# EAGLE design BLE_Node (EAGLE 6.5.0)
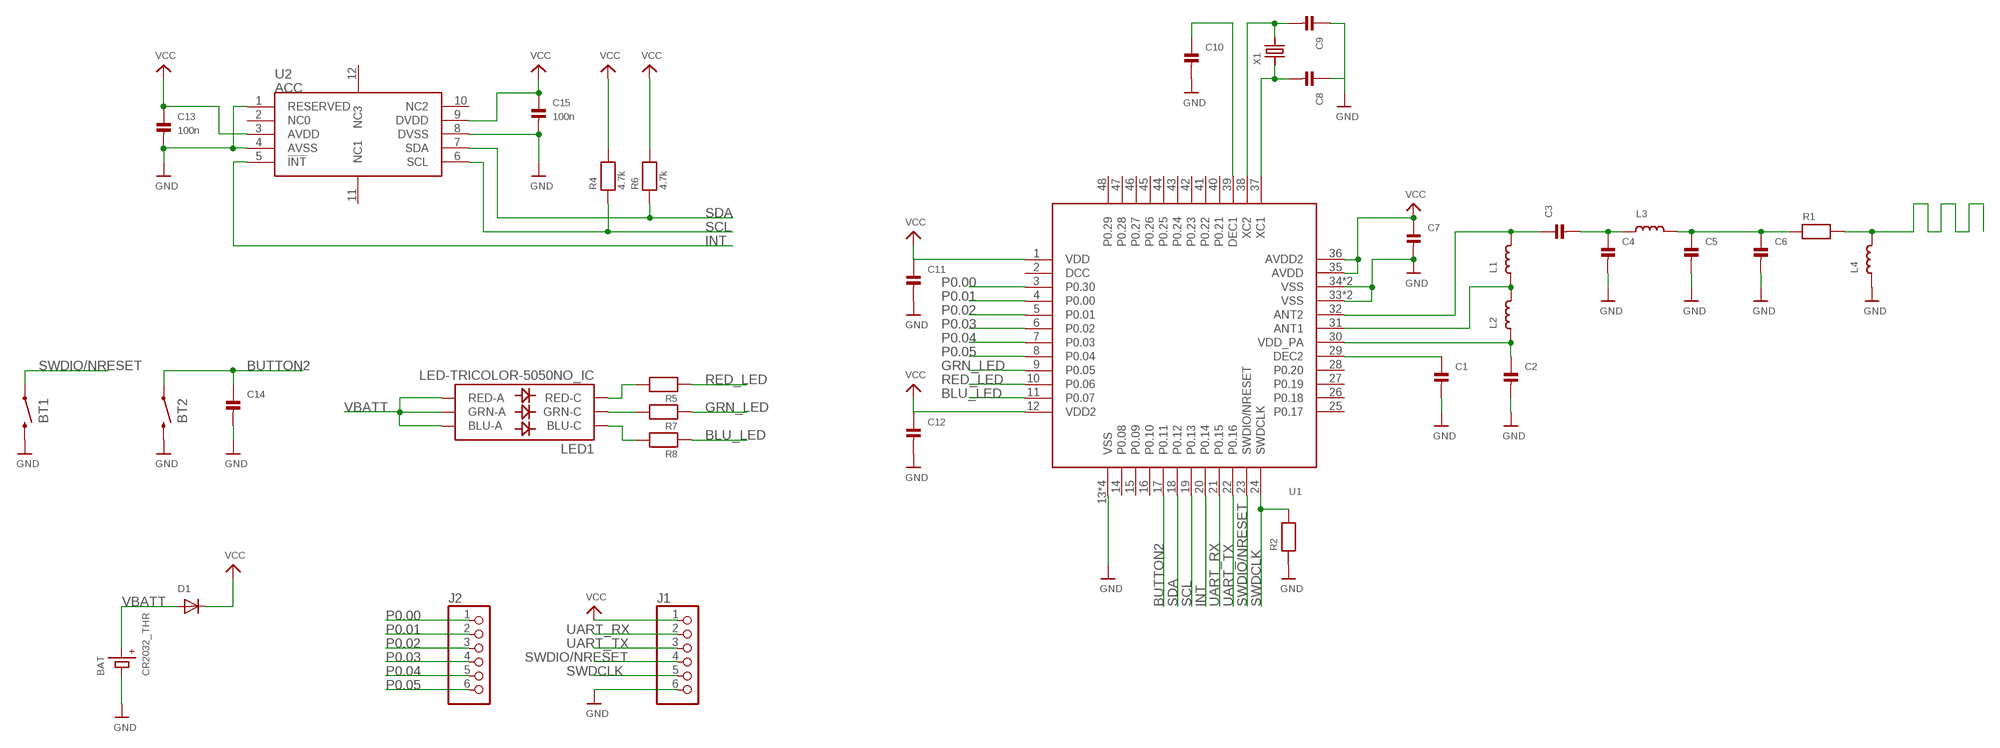
[diagram p0: schematic, sheet 1]

## Parts
BAT  CR2032_THR  [CR2032_THR]
BT1  TACT_SWITCH_3.5MM_6MM  [TACT_SW_3.5MM_6MM]
BT2  TACT_SWITCH_3.5MM_6MM  [TACT_SW_3.5MM_6MM]
C1  NRF51_CAP_0402  [NRF51_CAP_0402]
C2  NRF51_CAP_0402  [NRF51_CAP_0402]
C3  NRF51_CAP_0402  [NRF51_CAP_0402]
C4  NRF51_CAP_0402  [NRF51_CAP_0402]
C5  NRF51_CAP_0402  [NRF51_CAP_0402]
C6  NRF51_CAP_0402  [NRF51_CAP_0402]
C7  NRF51_CAP_0402  [NRF51_CAP_0402]
C8  NRF51_CAP_0402  [NRF51_CAP_0402]
C9  NRF51_CAP_0402  [NRF51_CAP_0402]
C10  NRF51_CAP_0402  [NRF51_CAP_0402]
C11  NRF51_CAP_0402  [NRF51_CAP_0402]
C12  NRF51_CAP_0402  [NRF51_CAP_0402]
C13  100n  NRF51_CAP_0402  [NRF51_CAP_0402]
C14  NRF51_CAP_0402  [NRF51_CAP_0402]
C15  100n  NRF51_CAP_0402  [NRF51_CAP_0402]
D1  DIODESOT23_REFLOW  [SOT23-R]
J1  HEADER-1X6ROUND  [1X06_ROUND]
J2  HEADER-1X6ROUND  [1X06_ROUND]
L1  NRF51_IND_0402  [NRF51_IND_0402]
L2  NRF51_IND_0402  [NRF51_IND_0402]
L3  NRF51_IND_0402  [NRF51_IND_0402]
L4  NRF51_IND_0402  [NRF51_IND_0402]
LED1  LED-TRICOLOR-5050NO_IC  [LED-TRICOLOR-5050]
R1  NRF51_RES_0402  [NRF51_RES_0402]
R2  NRF51_RES_0402  [NRF51_RES_0402]
R4  4.7k  NRF51_RES_0402  [NRF51_RES_0402]
R5  NRF51_RES_0402  [NRF51_RES_0402]
R6  4.7k  NRF51_RES_0402  [NRF51_RES_0402]
R7  NRF51_RES_0402  [NRF51_RES_0402]
R8  NRF51_RES_0402  [NRF51_RES_0402]
U1  NRF51822_QFN48  [NORDIC_QFN48]
U2  ACC  MMA7660FC_DFN10  [DFN10]
X1  TSX-3225_16MHZ  [XTAL_3.2X2.5]

## Nets
BLU_LED: R8.1 U1.11(P0.07)
BUTTON2: BT2.1 C14.1 U1.17(P0.11)
GND: BAT.5(-) BT1.2 BT2.2 C1.2 C2.2 C4.2 C5.2 C6.2 C7.2 C8.1 C9.1 C10.2 C11.2 C12.2 C13.2 C14.2 C15.2 J1.6 L4.1 R2.1 U1.13(VSS) U1.33(VSS) U1.34(VSS) U1.49(VSS) U1.50(VSS) U1.51(VSS) U1.52(VSS) U1.53(VSS) U2.1(RESERVED) U2.4(AVSS) U2.8(DVSS)
GRN_LED: R7.1 U1.9(P0.05)
INT: U1.20(P0.14) U2.5(!INT)
N$1: L1.1 L2.2 U1.31(ANT1)
N$2: C1.1 U1.29(DEC2)
N$3: C2.1 L2.1 U1.30(VDD_PA)
N$4: C3.1 L1.2 U1.32(ANT2)
N$5: C3.2 C4.1 L3.1
N$6: C5.1 C6.1 L3.2 R1.1
N$7: L4.2 R1.2
N$9: C8.2 U1.37(XC1) X1.1
N$10: C9.2 U1.38(XC2) X1.3
N$11: C10.1 U1.39(DEC1)
N$12: LED1.5(RED-C) R5.2
N$13: LED1.6(GRN-C) R7.2
N$14: LED1.4(BLU-C) R8.2
P0.00: J2.1 U1.3(P0.30)
P0.01: J2.2 U1.4(P0.00)
P0.02: J2.3 U1.5(P0.01)
P0.03: J2.4 U1.6(P0.02)
P0.04: J2.5 U1.7(P0.03)
P0.05: J2.6 U1.8(P0.04)
RED_LED: R5.1 U1.10(P0.06)
SCL: R4.1 U1.19(P0.13) U2.6(SCL)
SDA: R6.1 U1.18(P0.12) U2.7(SDA)
SWDCLK: J1.5 R2.2 U1.24(SWDCLK)
SWDIO/NRESET: BT1.1 J1.4 U1.23(SWDIO/NRESET)
UART_RX: J1.2 U1.21(P0.15)
UART_TX: J1.3 U1.22(P0.16)
VBATT: BAT.1(+) BAT.2(+) BAT.3(+) BAT.4(+) D1.1(A) LED1.1(GRN-A) LED1.2(RED-A) LED1.3(BLU-A)
VCC: C7.1 C11.1 C12.1 C13.1 C15.1 D1.3(C) J1.1 R4.2 R6.2 U1.1(VDD) U1.12(VDD2) U1.35(AVDD) U1.36(AVDD2) U2.3(AVDD) U2.9(DVDD)
Unconnected: U1.2(DCC) U1.14(P0.08) U1.15(P0.09) U1.16(P0.10) U1.25(P0.17) U1.26(P0.18) U1.27(P0.19) U1.28(P0.20) U1.40(P0.21) U1.41(P0.22) U1.42(P0.23) U1.43(P0.24) U1.44(P0.25) U1.45(P0.26) U1.46(P0.27) U1.47(P0.28) U1.48(P0.29) U2.2(NC0) U2.10(NC2) U2.11(NC1) U2.12(NC3)

## Library data of the parts
BAT = wavelette:CR2032_THR
BT1 BT2 = wavelette:TACT_SWITCH_3.5MM_6MM
C1-C15 = microbuilder:NRF51_CAP_0402
D1 = microbuilder:DIODE: Diode SMA Model Volts Amps Type Vf Vr Digikey # Notes SSA34-E3 40V 3A Schottky 480mV @ 3A 200uA @ 40V SSA34-E3/61TGITR-ND CDBA120-G 20V 1A Schottky 500mV @ 1A 500uA @ 20V 641-1014-6-ND REEL MBRA210 10V 2A Schottky 350mV @ 2A 700uA @ 10V MBRA210LT3 SOD-123 Model Volts Amps Type Vf Vr Order # Notes BAT54T1G 30V 200mA Schottky 800mV @ 200mA 2uA @ 25V BAT54T1GOSTR-ND B0530W 30V 500mA Schottky 430mV @ 500mA 130uA @ 30V B0530W-FDICT-ND REEL MBR120 1A 20V Schottky 340mV @ 1A MBR120VLSFT1GOSCT-ND SOD-323 Model Volts Amps Type Vf Vr Order # Notes PMEG2005EJ 20V 500mA Schottky 355mV @ 500mA 568-4110-1-ND ZLLS410 10V 570mA Schottky 380mV @ 570mA ZLLS410CT-ND 1N4148WS 75V 150mA Silicon/Simple 1V 1N4148WSFSCT-ND REEL SOD-523 Model Volts Amps Type Vf Vr Order # Notes BAT54XV2 30V 200mA Schottky 0.8V @ 100mA BAT54XV2CT-ND TB751S 30V 30mA Schottky RB751S-40TE61CT-ND SOT23-R/W (R = Solder Paste/Reflow Ovens, W = Hand-Soldering) Model Volts Amps Type Vf Vr Order # Notes BAT54FILM 40V 300mA Schottky 497-7162-1-ND
J1 J2 = microbuilder:HEADER-1X6: PIN HEADER
L1-L4 = microbuilder:NRF51_IND_0402
LED1 = SparkFun-LED:LED-TRICOLOR-5050
R1 R2 R4-R8 = microbuilder:NRF51_RES_0402
U1 = wavelette:NRF51822_QFN48
U2 = ICs_v54:MMA7660FC
X1 = wavelette:TSX-3225_16MHZ

## Board
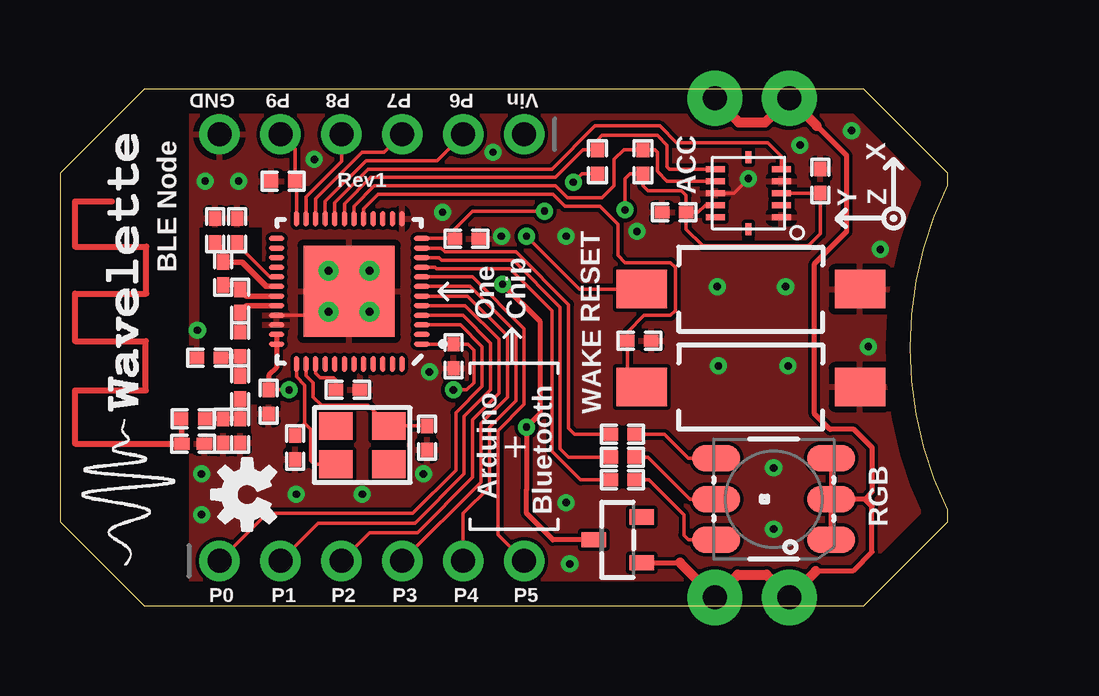
[diagram p1: board, top side]
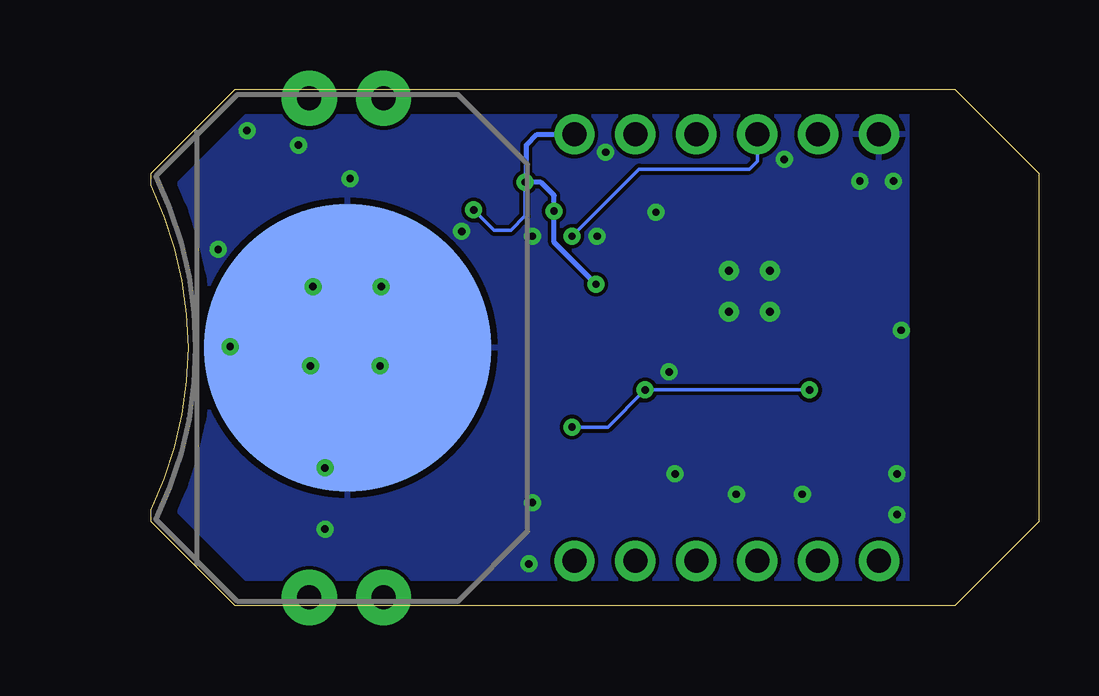
[diagram p2: board, bottom side, seen from below]

Size 37 x 21.52 mm. Coordinates in mm from the lower left corner, seen from the top.
Outline: 3.5,0 33.5,0 37,3.5 37,4 arc-52 37,17.52 37,18.02 33.5,21.52 3.5,21.52 0,18.02 0,3.5 3.5,0
Copper layers (1*16): Top 0.035mm / dielectric 1.5mm / Bottom 0.035mm
Design rules "default *": minimum track width 6mil, minimum drill 12mil, track to track 6mil, track to pad 6mil, pad to pad 6mil, via to via 6mil, smd to smd 0mil, copper to edge 40mil, drill to drill 8mil, minimum pad ring 10mil, minimum via ring 8mil, stop-mask expansion 4mil, vias tented up to drill 14mil, thermal gap 10mil
tRestrict: area 5.8,9.2 to 8.4,15.8; area 5.2,8.4 to 8.8,10; area 5.1,7.2 to 7.9,8.8; area 0,0 to 5.4,21.5
bRestrict: area 0,0 to 5.4,21.5

### Footprints (pad centres in the part's own frame; a part is rotated, then mirrored left to right if it is on the bottom)
CR2032_THR = drill 1 pad 2.3: 1 -10.4,1.5; 2 -10.4,-1.6; 3 10.4,1.5; 4 10.4,-1.6 | smd 12 x 12: 5 0,0
TACT_SW_3.5MM_6MM = smd 2.1 x 1.6: 1 -4.55,0; 2 4.55,0
NRF51_CAP_0402 = smd 0.6 x 0.5: 1 -0.5,0; 2 0.5,0
SOT23-R = smd 0.635 x 1.016: 1 -0.95,-1; 2 0.95,-1; 3 0,1
1X06_ROUND = drill 1 pad 1.676: 1 -6.35,0; 2 -3.81,0; 3 -1.27,0; 4 1.27,0; 5 3.81,0; 6 6.35,0
NRF51_IND_0402 = smd 0.65 x 0.5: 1 -0.475,0; 2 0.475,0
LED-TRICOLOR-5050 = smd 2 x 1.1: 1 -2.4,1.7; 2 -2.4,0; 3 -2.4,-1.7; 4 2.4,-1.7; 5 2.4,0; 6 2.4,1.7
NRF51_RES_0402 = smd 0.6 x 0.55: 1 -0.5,0; 2 0.5,0
NORDIC_QFN48 = smd 0.65 x 0.2: 1 -3.025,2.2; 2 -3.025,1.8; 3 -3.025,1.4; 4 -3.025,1; 5 -3.025,0.6; 6 -3.025,0.2; 7 -3.025,-0.2; 8 -3.025,-0.6; 9 -3.025,-1; 10 -3.025,-1.4; 11 -3.025,-1.8; 12 -3.025,-2.2; 25 3.025,-2.2; 26 3.025,-1.8; 27 3.025,-1.4; 28 3.025,-1; 29 3.025,-0.6; 30 3.025,-0.2; 31 3.025,0.2; 32 3.025,0.6; 33 3.025,1; 34 3.025,1.4; 35 3.025,1.8; 36 3.025,2.2 | smd 0.2 x 0.65: 13 -2.2,-3.025; 14 -1.8,-3.025; 15 -1.4,-3.025; 16 -1,-3.025; 17 -0.6,-3.025; 18 -0.2,-3.025; 19 0.2,-3.025; 20 0.6,-3.025; 21 1,-3.025; 22 1.4,-3.025; 23 1.8,-3.025; 24 2.2,-3.025; 37 2.2,3.025; 38 1.8,3.025; 39 1.4,3.025; 40 1,3.025; 41 0.6,3.025; 42 0.2,3.025; 43 -0.2,3.025; 44 -0.6,3.025; 45 -1,3.025; 46 -1.4,3.025; 47 -1.8,3.025; 48 -2.2,3.025 | smd 3.8 x 3.8: 49 0,0 | drill 0.33 pad 0.66: 50 -0.85,0.85; 51 0.85,0.85; 52 -0.85,-0.85; 53 0.85,-0.85
DFN10 = smd 0.8 x 0.25: 1 -1.375,1; 2 -1.375,0.5; 3 -1.375,0; 4 -1.375,-0.5; 5 -1.375,-1; 6 1.375,-1; 7 1.375,-0.5; 8 1.375,0; 9 1.375,0.5; 10 1.375,1 | smd 0.25 x 0.5: 11 0,-1.5; 12 0,1.5
XTAL_3.2X2.5 = smd 1.4 x 1.15: 1 -1.1,-0.8; 2 1.1,-0.8; 3 1.1,0.8; 4 -1.1,0.8

### Placement (x,y rotation side)
BAT  28.8,10.75 270 bottom
BT1  28.8,13.2 0 top
BT2  28.8,9.12 0 top
C1  7.38,15.65 90 top
C2  6.47,15.65 90 top
C3  7.51,10.9 270 top
C4  6.21,10.34 180 top
C5  7.51,7.29 270 top
C6  6.8,7.29 270 top
C7  8.7,8.5 270 top
C8  9.8,6.6 90 top
C9  15.3,7 90 top
C10  12,9 0 top
C11  16.4,10.4 270 top
C12  16.95,15.3 0 top
C13  31.7,17.7 90 top
C14  24.15,11.05 0 top
C15  25.6,16.4 180 top
D1  23.25,2.75 90 top
J1  13,19.65 180 top
J2  13,1.87 0 top
L1  7.51,12.7 270 top
L2  6.8,13.84 270 top
L3  7.51,9.09 270 top
L4  5.55,6.76 180 top
LED1  29.75,4.45 180 top
R1  5.55,7.8 180 top
R2  9.3,17.7 0 top
R4  22.4,18.5 270 top
R5  23.45,6.2 0 top
R6  24.3,18.5 270 top
R7  23.45,5.25 0 top
R8  23.45,7.15 0 top
U1  12.05,13.11 180 top
U2  28.7,17.2 180 top
U$9  [OSHW-LOGO-S]  7.8,4.64 90 top
U$11  [LOGO4]  5,1.7 90 top
X1  12.6,6.7 0 top

### Tracks (layer width: path | path; a pad name or v marks a point on that pad's centre or on a via)
BLU_LED
  Top 0.152: U1.11 15.89,14.91 16.05,14.75 19,14.75 21.2,12.55 21.2,7.4 21.45,7.15 R8.1
BUTTON2
  Top 0.152: U1.17 12.65,16.55 13.25,17.15 20.55,17.15 21.05,16.65 22.5,16.65 23.25,15.9 23.25,14.6 23.55,14.3 25.45,14.3 25.65,14.1 25.65,12.3 25.45,12.1 24.35,12.1 23.65,11.4 C14.1 23.65,9.72 BT2.1 | 24.1,9.67 BT2.1 | 24.7,9.57 BT2.1
GND  (via drill 0.3, 0.3 pad 0.61)
  Top 0.152: U2.8 28.1,17.2 v28.7,17.8 | U1.33 11.05,12.11 U1.51
  other vias: 5.9,5.5 5.73,11.48 5.9,3.8 33.7,10.8 15.15,5.5 12.6,4.65 9.85,4.65 6.05,17.7 15.95,16.4 27.4,13.3 27.45,10 30.25,13.3 34.2,14.85 33,19.8 15.4,9.75 30.35,10 7.45,17.7 29.75,3.2 21.1,4.3 21.25,1.75 18.4,15.4 18.05,18.9 10.6,18.6 21.1,15.4 29.75,5.75 30.85,19.2 24.05,15.6
  pour Top: -5,23.6 42,23.6 42,-2.4 -5,-2.4
  pour Bottom: -5,23.6 42,23.6 42,-2.4 -5,-2.4
GRN_LED
  Top 0.152: U1.9 15.64,14.11 15.7,14.05 18.75,14.05 20.5,12.3 20.5,6.45 21.7,5.25 R7.1
INT
  Top 0.152: U2.5 30.07,18.73 29.5,19.3 25.7,19.3 25,20 22.3,20 20.5,18.2 12.85,18.2 11.46,16.8 U1.20
N$1
  Top 0.229: U1.31 7.78,12.91 L1.1 7.32,13.37 L2.2
N$2
  Top 0.152: U1.29 8.74,13.71 7.38,15.06 C1.1
N$3
  Top 0.229: C2.1 6.8,14.82 L2.1 7.59,14.32 8.6,13.31 U1.30
N$4
  Top 0.229: U1.32 7.79,12.51 L1.2 C3.1
N$5
  Top 0.229: L3.1 C3.2 6.77,10.4 C4.1
N$6
  Top 0.229: L3.2 C5.1 C6.1 R1.1
N$7
  Top 0.229: L4.2 5.08,7.77 R1.2
N$8
  Top 0.254: 5.08,6.76 0.63,6.76 0.63,8.98 3.58,8.98 3.58,11.03 0.63,11.03 0.63,13.01 3.6,13.01 3.6,14.97 0.63,14.97 0.63,16.85 2.16,16.85
N$9
  Top 0.152: U1.37 9.86,9.54 10.2,9.2 10.2,7.6 | 10.2,7.6 10.45,7.35 10.45,6.05 10.6,5.9 X1.1 | C8.2 9.8,7.2 10.2,7.6
N$10
  Top 0.152: U1.38 10.26,9.59 10.55,9.3 10.55,8.7 10.9,8.35 12.85,8.35 X1.3 C9.2
N$11
  Top 0.152: U1.39 10.65,9.7 10.85,9.5 11.4,9.5 11.5,9.4 C10.1
N$12
  Top 0.152: LED1.5 26.25,4.45 24.5,6.2 R5.2
N$13
  Top 0.152: R7.2 24.55,5.25 26,3.8 26,2.95 26.2,2.75 LED1.6
N$14
  Top 0.152: R8.2 25.2,7.15 26.2,6.15 LED1.4
P0.00
  Top 0.152: U1.3 16.69,11.71 17.6,10.8 17.6,9.15 16.5,8.05 16.5,5.65 14.7,3.85 8.63,3.85 J2.1
P0.01
  Top 0.152: U1.4 16.79,12.11 17.95,10.95 17.95,9 16.85,7.9 16.85,5.5 14.8,3.45 10.77,3.45 J2.2
P0.02
  Top 0.152: U1.5 16.89,12.51 18.3,11.1 18.3,8.85 17.2,7.75 17.2,5.35 14.9,3.05 12.91,3.05 J2.3
P0.03
  Top 0.152: U1.6 16.99,12.91 18.65,11.25 18.65,8.7 17.55,7.6 17.55,5.15 J2.4
P0.04
  Top 0.152: U1.7 17.09,13.31 19,11.4 19,8.55 17.9,7.45 17.9,4.95 16.81,3.86 J2.5
P0.05
  Top 0.152: U1.8 17.19,13.71 19.35,11.55 19.35,8.4 18.25,7.3 18.25,2.97 J2.6
RED_LED
  Top 0.152: U1.10 15.79,14.51 15.9,14.4 18.9,14.4 20.85,12.45 20.85,6.55 21.2,6.2 R5.1
SCL
  Top 0.152: U2.6 25.4,18.2 25.3,18.3 25.3,19.2 24.9,19.6 22.6,19.6 22.4,19.4 R4.1 21.8,19 20.65,17.85 12.95,17.85 11.86,16.76 U1.19
SDA
  Top 0.152: U2.7 25.3,17.7 24.9,18.1 24.9,18.9 24.8,19 R6.1 23.5,19 23.1,18.6 23.1,17.5 22.6,17 21.15,17 20.65,17.5 13.1,17.5 12.26,16.66 U1.18
SWDCLK
  Top 0.152: U1.24 9.86,17.65 R2.2 9.8,19.04 J1.5
SWDIO/NRESET  (via drill 0.3)
  Top 0.152: U1.23 10.26,17.05 11.73,18.53 J1.4 | BT1.1 21.65,13.2 v19.45,15.4
  Bottom 0.152: v19.45,15.4 16.65,18.2 12.06,18.2 11.73,18.53 J1.4
UART_RX
  Top 0.152: U1.21 11.05,16.86 12.75,18.55 15.71,18.55 J1.2
UART_TX
  Top 0.152: J1.3 13.52,18.9 12.6,18.9 10.65,16.96 U1.22
VBATT
  Top 0.203: 31.55,20 32.8,18.75 32.8,15.6 31.45,14.25 31.45,8 32.1,7.35 33.1,7.35 33.85,6.6 33.85,4.75 33.55,4.45 | 31.5,1.45 33.05,1.45 33.85,2.25 33.85,4.15 33.55,4.45 | D1.1 25.85,1.8 | 33.55,4.45 LED1.2 | LED1.1 LED1.2 | LED1.3 LED1.2
  Top 0.406: BAT.1 28.3,20.15 29.4,20.15 BAT.2 31.55,20 | 31.5,1.45 BAT.4 29.45,1.3 28.25,1.3 BAT.3 25.85,1.8
VCC  (via drill 0.3)
  Top 0.152: C15.1 26.1,15.7 26.8,15 31.2,15 31.7,15.5 C13.1 U2.3 | U2.9 26.9,16.7 26.6,16.4 C15.1 | C15.1 26.1,17.1 25.9,17.3 24.5,17.3 24.3,17.5 R6.2 23.75,18 23.55,17.8 v23.55,16.5 | R4.2 21.75,18 v21.4,17.65 | U1.12 C12.1 16.45,15.7 17.2,16.45 v20.2,16.45 | U1.1 C11.1 17,10.9 17.25,10.65 17.25,9.3 16.95,9 v16.4,9 | C7.1 v9.55,9
  Top 0.203: U1.35 U1.36 9.03,9.93 8.7,9.6 C7.1 | v18.45,13.4 20,11.85 20,8 v19.45,7.45 19.45,4.85 19.45,3.85 20.55,2.75 D1.3
  Bottom 0.152: v9.55,9 v16.4,9 | v16.4,9 16.4,8.95 | v19.45,7.45 17.95,7.45 v16.4,9 | v23.55,16.5 22.7,15.65 22,15.65 21.4,16.25 v21.4,17.65 21.35,17.65
  Bottom 0.203: J1.1 20.9,19.65 21.35,19.2 21.35,17.65 20.75,17.65 20.2,17.1 v20.2,16.45 20.2,15.15 v18.45,13.4

### Text on the board
tPlace: GND | P9 | P8 | P7 | P6 | Vin | X | Rev1 | ACC | Y | Z | BLE Node | One | Chip | RESET | WAKE | + | Arduino | Bluetooth | RGB | P0 | P1 | P2 | P3 | P4 | P5